# Altium schematic sheet TC264MCU.SchDoc
size A2
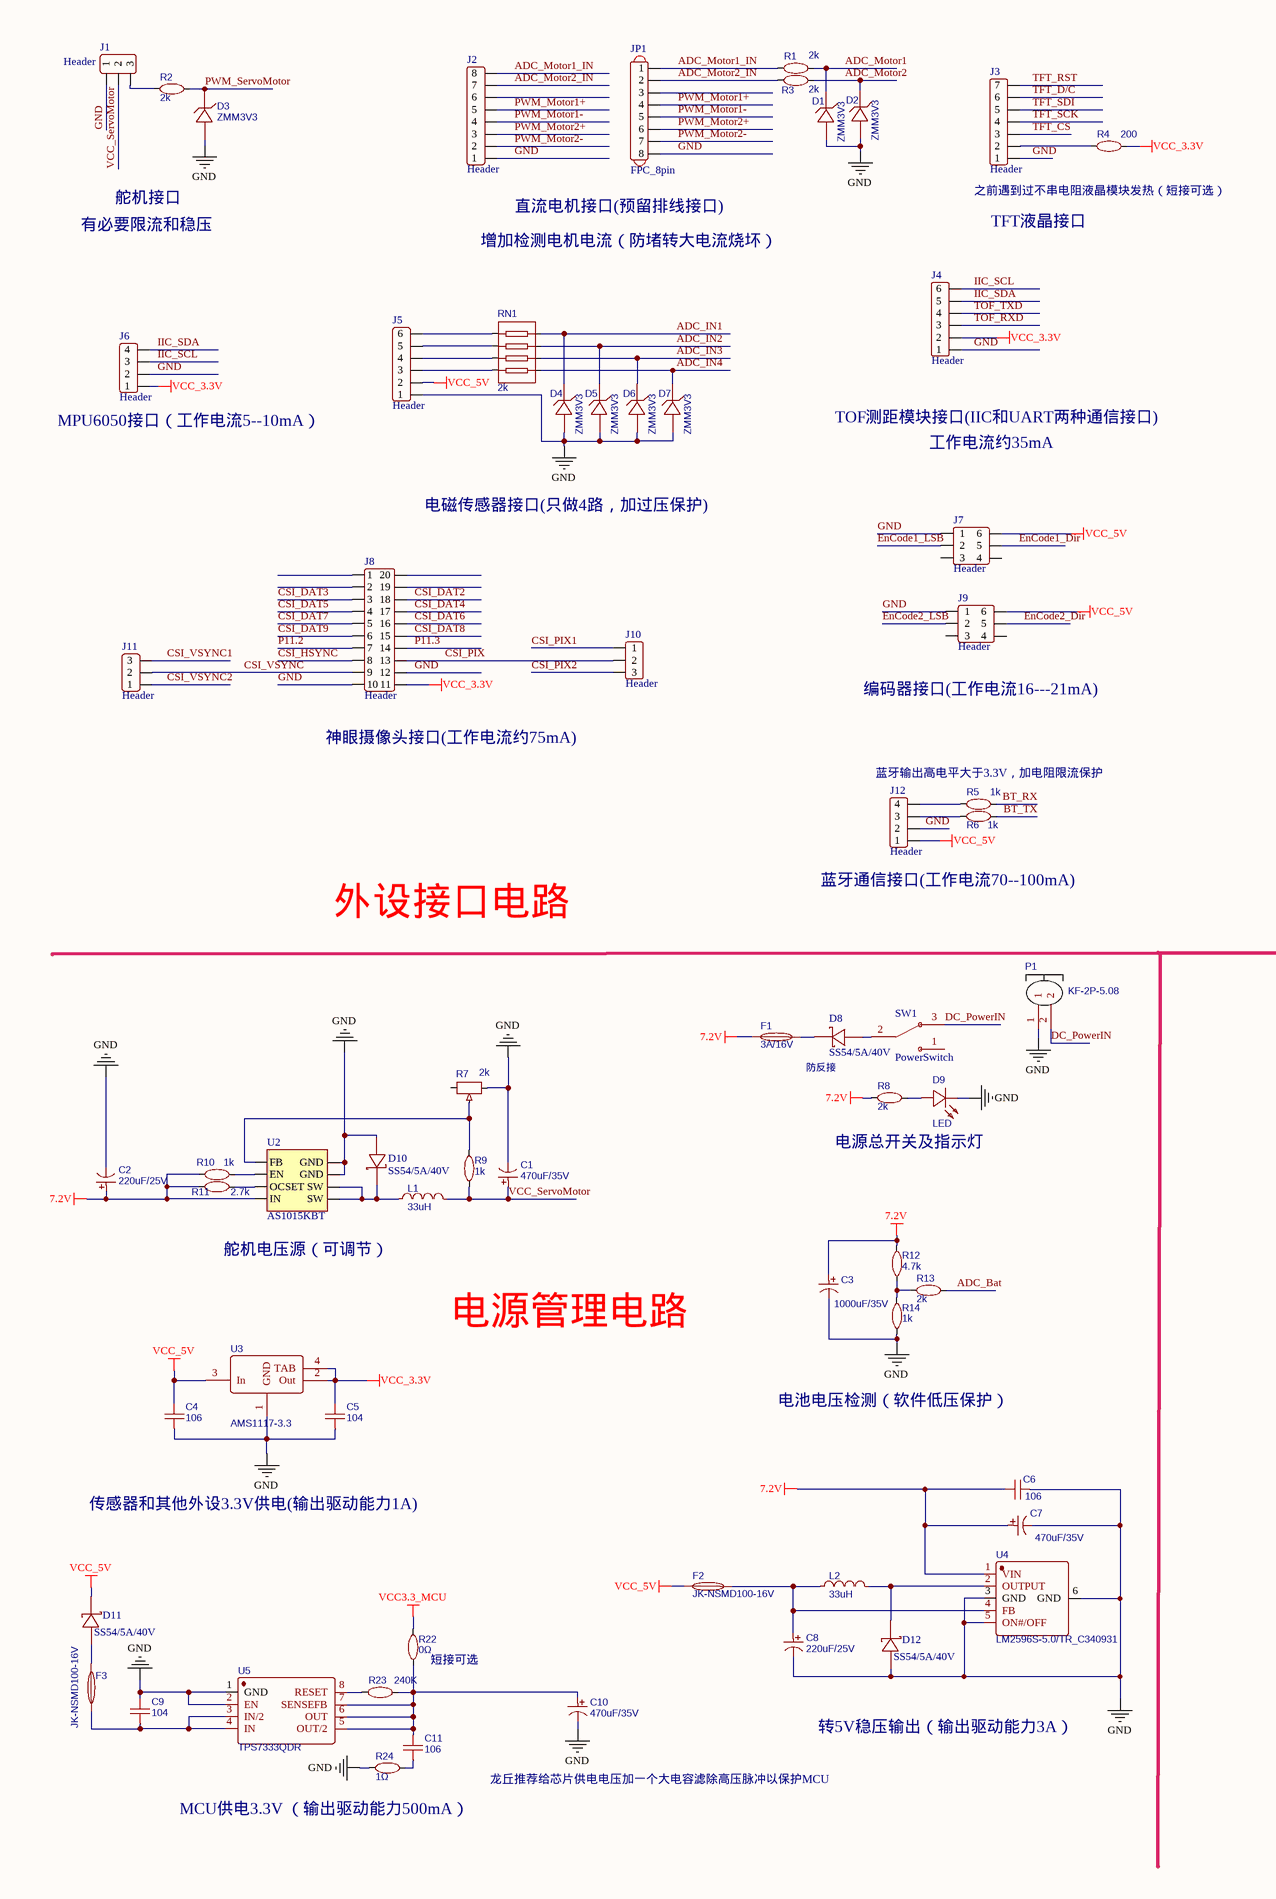
[diagram p0: TC264MCU.SchDoc, left]
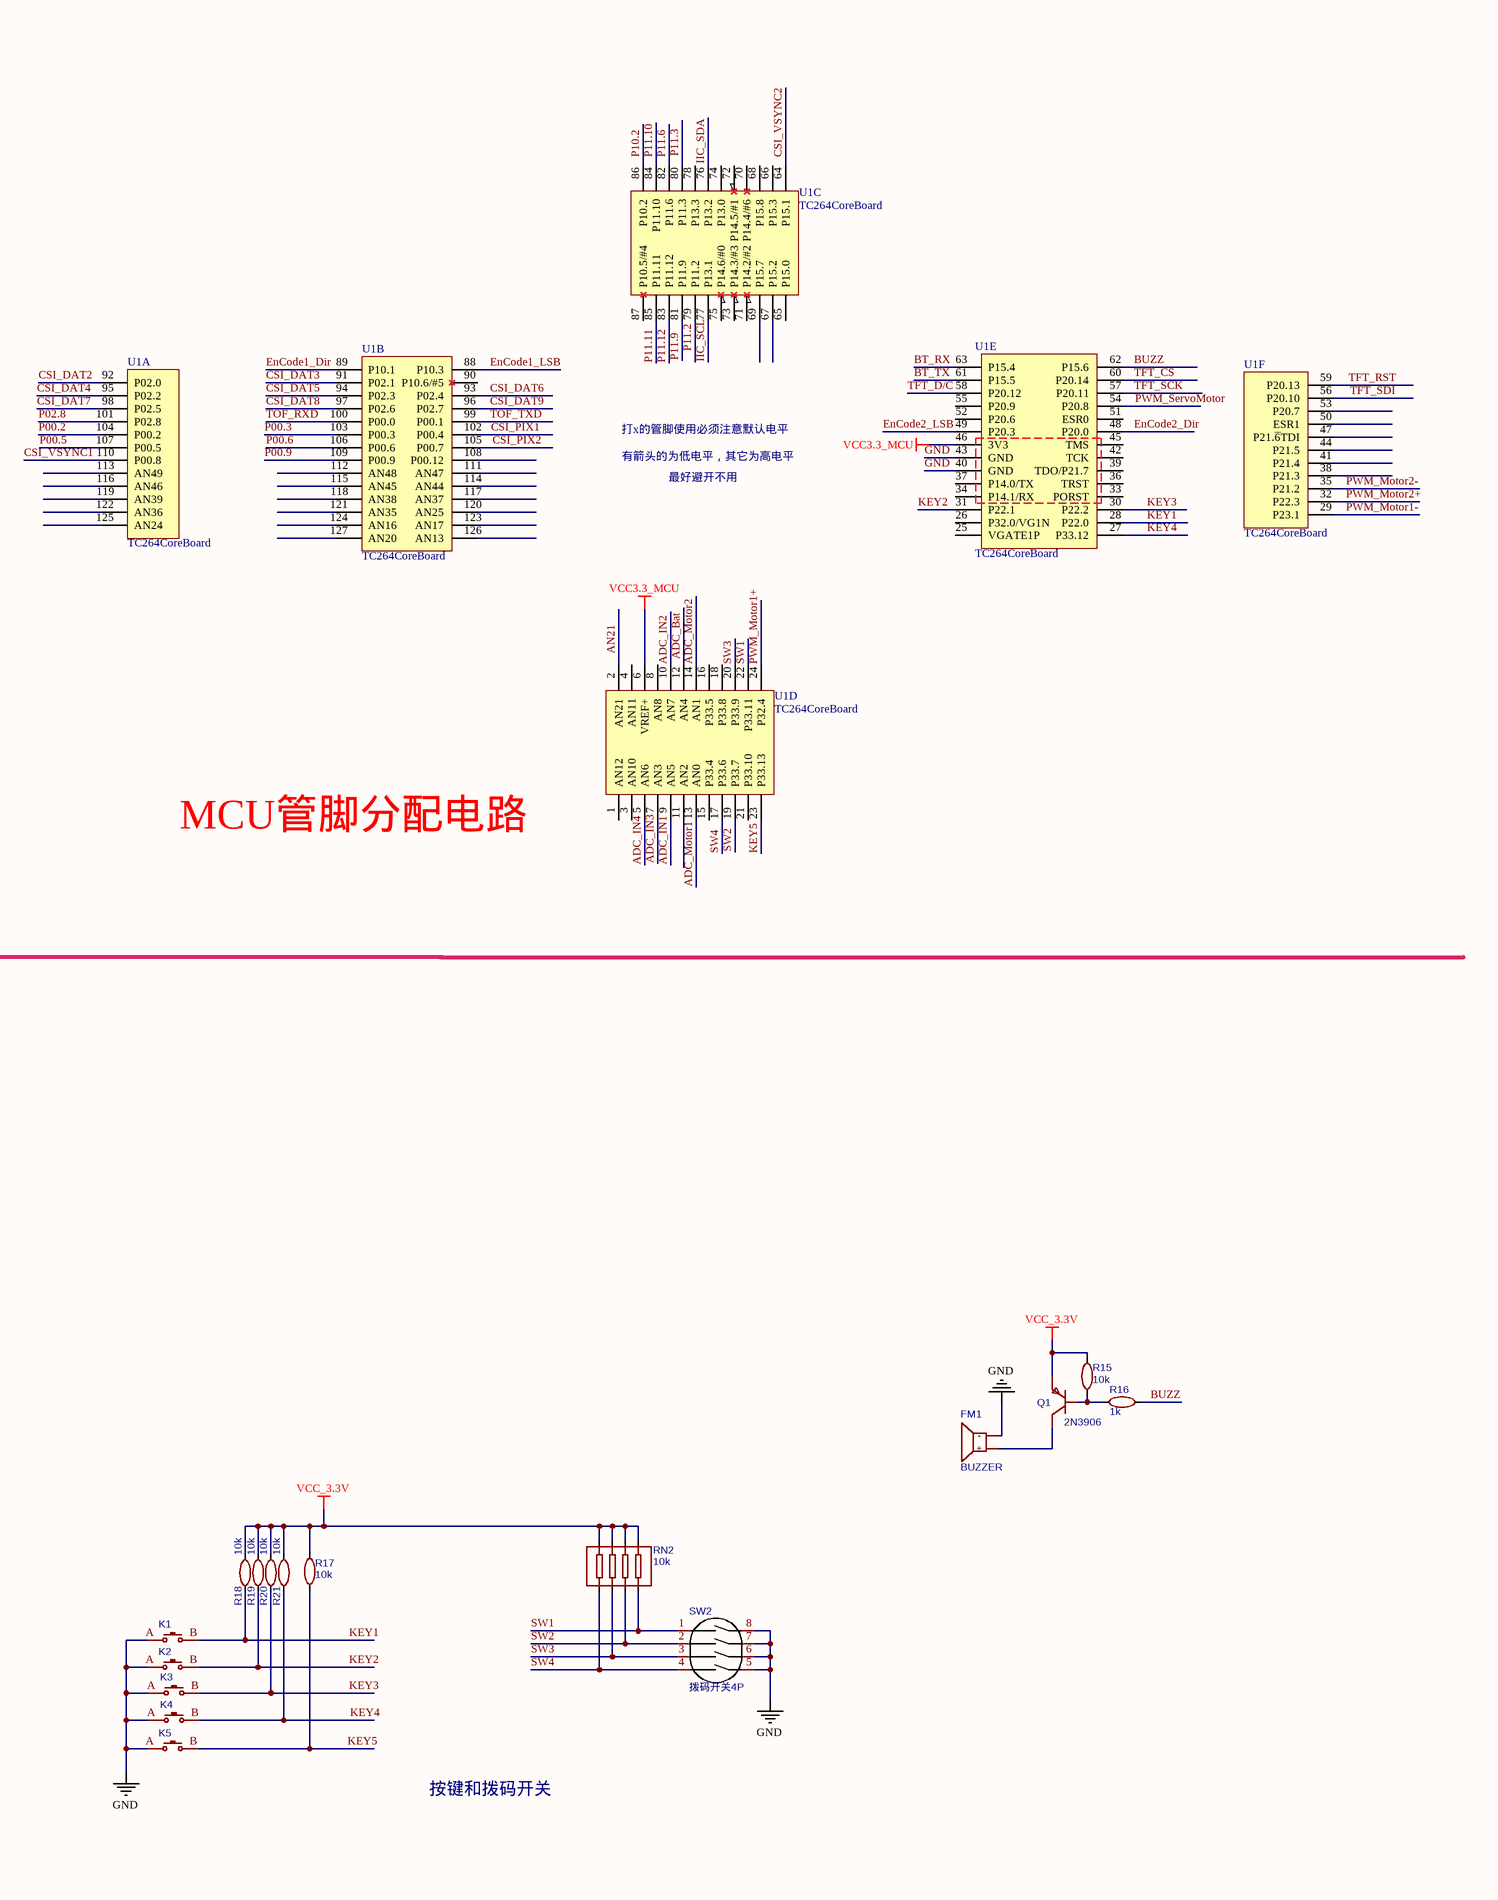
[diagram p1: TC264MCU.SchDoc, right]

## Parts
C1  470uF/35V  [CAPE_SMD_F_8.4]
C2  220uF/25V  [CAPE_SMD_D_6.4]
C3  1000uF/35V  [CAPE_SMD_G_10.6]
C4  106  [CAP_0603]
C5  104  [CAP_0603]
C6  106  [CAP_0603]
C7  470uF/35V  [CAPE_SMD_F_8.4]
C8  220uF/25V  [CAPE_SMD_D_6.4]
C9  104  [CAP_0603]
C10  470uF/35V  [CAPE_SMD_F_8.4]
C11  106  [CAP_0603]
D1  ZMM3V3  [LL-34_L3.5-W1.5-RD]
D2  ZMM3V3  [LL-34_L3.5-W1.5-RD]
D3  ZMM3V3  [LL-34_L3.5-W1.5-RD]
D4  ZMM3V3  [LL-34_L3.5-W1.5-RD]
D5  ZMM3V3  [LL-34_L3.5-W1.5-RD]
D6  ZMM3V3  [LL-34_L3.5-W1.5-RD]
D7  ZMM3V3  [LL-34_L3.5-W1.5-RD]
D8  SS54/5A/40V  [DO214_SMA]
D9  LED  [LED_0603_B]
D10  SS54/5A/40V  [DO214_SMA]
D11  SS54/5A/40V  [DO214_SMA]
D12  SS54/5A/40V  [DO214_SMA]
F1  3A/16V  [F1206]
F2  JK-NSMD100-16V  [F1206]
F3  JK-NSMD100-16V  [F1206]
FM1  BUZZER  [BUZZ-12*7.5]
J1  Header  [Header 2.54X3]
J2  Header  [Header 2.54X8]
J3  Header  [Header F 2.54X7]
J4  Header  [Header 2.54X6]
J5  Header  [Header 2.54X6]
J6  Header  [Header 2.54X4]
J7  Header  [Header 2.54_2X3]
J8  Header  [Header F 2.54_2x10]
J9  Header  [Header 2.54_2X3]
J10  Header  [Header 2.54X3]
J11  Header  [Header 2.54X3]
J12  Header  [Header F 2.54X4]
JP1  FPC_8pin  [FPC_1.0_8P]
K1  TS-Button_2P  [SW_SMD_6.1*3.7]  (value not drawn)
K2  TS-Button_2P  [SW_SMD_6.1*3.7]  (value not drawn)
K3  TS-Button_2P  [SW_SMD_6.1*3.7]  (value not drawn)
K4  TS-Button_2P  [SW_SMD_6.1*3.7]  (value not drawn)
K5  TS-Button_2P  [SW_SMD_6.1*3.7]  (value not drawn)
L1  33uH  [IND-SMD_L8.0-W8.0]
L2  33uH  [IND-SMD_L8.0-W8.0]
P1  KF-2P-5.08  [KF_2P-5.08]
Q1  2N3906  [TO_92A]
R1  2k  [RES_0603]
R2  2k  [RES_0603]
R3  2k  [RES_0603]
R4  200  [RES_0603]
R5  1k  [RES_0603]
R6  1k  [RES_0603]
R7  2k  [RES_POT-3296W]
R8  2k  [RES_0603]
R9  1k  [RES_0603]
R10  1k  [RES_0603]
R11  2.7k  [RES_0603]
R12  4.7k  [RES_0603]
R13  2k  [RES_0603]
R14  1k  [RES_0603]
R15  10k  [RES_0603]
R16  1k  [RES_0603]
R17  10k  [RES_0603]
R18  10k  [RES_0603]
R19  10k  [RES_0603]
R20  10k  [RES_0603]
R21  10k  [RES_0603]
R22  0Ω  [RES_0603]
R23  240K  [RES_0603]
R24  1Ω  [RES_0603]
RN1  2k  [RES-ARRAY-SMD_0603-8P-L3.2-W1.6-BL]
RN2  10k  [RES-ARRAY-SMD_0603-8P-L3.2-W1.6-BL]
SW1  PowerSwitch  [SW-TH_K3-1260D-K1]
SW2  拨码开关4P  [MCEMR-04-T]
U1  TC264CoreBoard  [LQ-TC264-SYSVC-S]  (parts A,B,C,D,E,F of 6)
U2  AS1015KBT  [SOIC-8_150MIL]
U3  AMS1117-3.3  [SOT-223_3]
U4  LM2596S-5.0/TR_C340931  [TO-263_5]
U5  TPS7333QDR  [SOIC-8_150MIL]

## Nets
7.2V: C2.1 C3.1 C6.1 C7.1 F1.2 R8.2 R10.1 R11.1 R12.1 U2.4(IN) U4.1(VIN)
GND: C1.2 C2.2 C3.2 C4.2 C5.2 C6.2 C7.2 C8.2 C9.1 C10.2 D1.2(A) D2.2(A) D3.2(A) D4.2(A) D5.2(A) D6.2(A) D7.2(A) D9.C D10.1(A) D12.1(A) FM1.2(－) J1.1 J2.1 J3.1 J4.1 J5.1 J6.2 J7.1 J8.10 J8.12 J9.1 J12.2 JP1.8 K1.A K2.A K3.A K4.A K5.A P1.1 R7.1 R14.2 R24.1 SW2.5 SW2.6 SW2.7 SW2.8 U1.40(GND) U1.43(GND) U2.7(GND) U2.8(GND) U3.1(GND) U4.3(GND) U4.5(ON#/OFF) U4.6(GND) U5.1(GND) U5.2(EN)
VCC3.3_MCU: R22.2 U1.6(VREF+) U1.46(3V3)
VCC_3.3V: C5.1 J4.2 J6.1 J8.11 Q1.1(E) R4.1 R15.1 R17.2 R18.2 R19.2 R20.2 R21.2 RN2.5 RN2.6 RN2.7 RN2.8 U3.2(Out) U3.4(TAB)
VCC_5V: C4.1 D11.2(C) F2.2 J5.2 J7.6 J9.6 J12.1 U3.3(In)
ADC_Bat: R13.2 U1.12(AN4)
ADC_IN1: D4.1(C) RN1.8 U1.9(AN5)
ADC_IN2: D5.1(C) RN1.7 U1.10(AN7)
ADC_IN3: D6.1(C) RN1.6 U1.7(AN3)
ADC_IN4: D7.1(C) RN1.5 U1.5(AN6)
ADC_Motor1: D1.1(C) R1.1 U1.13(AN0)
ADC_Motor1_IN: J2.8 JP1.1 R1.2
ADC_Motor2: D2.1(C) R3.1 U1.14(AN1)
ADC_Motor2_IN: J2.7 JP1.2 R3.2
AN21: U1.2(AN21)
BT_RX: R5.1 U1.63(P15.4)
BT_TX: R6.1 U1.61(P15.5)
BUZZ: R16.1 U1.62(P15.6)
CSI_DAT2: J8.18 U1.92(P02.0)
CSI_DAT3: J8.3 U1.91(P02.1)
CSI_DAT4: J8.17 U1.95(P02.2)
CSI_DAT5: J8.4 U1.94(P02.3)
CSI_DAT6: J8.16 U1.93(P02.4)
CSI_DAT7: J8.5 U1.98(P02.5)
CSI_DAT8: J8.15 U1.97(P02.6)
CSI_DAT9: J8.6 U1.96(P02.7)
CSI_HSYNC: J8.8
CSI_PIX: J8.13 J10.2
CSI_PIX1: J10.1 U1.102(P00.4)
CSI_PIX2: J10.3 U1.105(P00.7)
CSI_VSYNC: J8.9 J11.2
CSI_VSYNC1: J11.3 U1.110(P00.8)
CSI_VSYNC2: J11.1 U1.64(P15.1)
DC_PowerIN: P1.2 SW1.3(NC)
EnCode1_Dir: J7.5 U1.89(P10.1)
EnCode1_LSB: J7.2 U1.88(P10.3)
EnCode2_Dir: J9.5 U1.48(P20.0)
EnCode2_LSB: J9.2 U1.49(P20.3)
IIC_SCL: J4.6 J6.3 U1.77(P13.1)
IIC_SDA: J4.5 J6.4 U1.76(P13.2)
KEY1: K1.B R18.1 U1.28(P22.0)
KEY2: K2.B R19.1 U1.31(P22.1)
KEY3: K3.B R20.1 U1.30(P22.2)
KEY4: K4.B R21.1 U1.27(P33.12)
KEY5: K5.B R17.1 U1.23(P33.13)
P00.2: U1.104(P00.2)
P00.3: U1.103(P00.3)
P00.5: U1.107(P00.5)
P00.6: U1.106(P00.6)
P00.9: U1.109(P00.9)
P02.8: U1.101(P02.8)
P10.2: U1.86(P10.2)
P11.2: J8.7 U1.79(P11.2)
P11.3: J8.14 U1.80(P11.3)
P11.6: U1.82(P11.6)
P11.9: U1.81(P11.9)
P11.10: U1.84(P11.10)
P11.11: U1.85(P11.11)
P11.12: U1.83(P11.12)
PWM_Motor1+: J2.5 JP1.4 U1.24(P32.4)
PWM_Motor1-: J2.4 JP1.5 U1.29(P23.1)
PWM_Motor2+: J2.3 JP1.6 U1.32(P22.3)
PWM_Motor2-: J2.2 JP1.7 U1.35(P21.2)
PWM_ServoMotor: D3.1(C) R2.1 U1.54(P20.8)
SW1: RN2.4 SW2.1 U1.22(P33.11)
SW2: RN2.3 SW2.2 U1.19(P33.7)
SW3: RN2.2 SW2.3 U1.20(P33.9)
SW4: RN2.1 SW2.4 U1.17(P33.6)
TFT_CS: J3.3 U1.60(P20.14)
TFT_D/C: J3.6 U1.58(P20.12)
TFT_RST: J3.7 U1.59(P20.13)
TFT_SCK: J3.4 U1.57(P20.11)
TFT_SDI: J3.5 U1.56(P20.10)
TOF_RXD: J4.3 U1.100(P00.0)
TOF_TXD: J4.4 U1.99(P00.1)
VCC_ServoMotor: C1.1 J1.2 L1.2 R9.1
NetC8_1: C8.1 F2.1 L2.1 U4.4(FB)
NetC9_2: C9.2 F3.1 U5.3(IN/2) U5.4(IN)
NetC10_1: C10.1 C11.1 R22.1 R23.2 U5.5(OUT/2) U5.6(OUT) U5.7(SENSEFB)
NetC11_2: C11.2 R24.2
NetD8_1: D8.1(A) SW1.2(C)
NetD8_2: D8.2(C) F1.1
NetD9_A: D9.A R8.1
NetD10_2: D10.2(C) L1.1 U2.5(SW) U2.6(SW)
NetD11_1: D11.1(A) F3.2
NetD12_2: D12.2(C) L2.2 U4.2(OUTPUT)
NetFM1_1: FM1.1(+) Q1.3(C)
NetJ1_3: J1.3 R2.2
NetJ3_2: J3.2 R4.2
NetJ5_3: J5.3 RN1.4
NetJ5_4: J5.4 RN1.3
NetJ5_5: J5.5 RN1.2
NetJ5_6: J5.6 RN1.1
NetJ12_3: J12.3 R6.2
NetJ12_4: J12.4 R5.2
NetQ1_2: Q1.2(B) R15.2 R16.2
NetR7_2: R7.2 R9.2 U2.1(FB)
NetR10_2: R10.2 U2.2(EN)
NetR11_2: R11.2 U2.3(OCSET)
NetR12_2: R12.2 R13.1 R14.1
NetR23_1: R23.1 U5.8(RESET)

Not connected (* = marked no-connect by the designer): J2 6; J7 3 4; J8 1 2 19 20; J9 3 4; JP1 3; R7 3; SW1 1(ON); U1 1(AN12) 3(AN10) 4(AN11) 8(AN8) 11(AN2) 15(P33.4) 16(P33.5) 18(P33.8) 21(P33.10) 25(VGATE1P) 26(P32.0/VG1N) 33(PORST) 34(P14.1/RX) 36(TRST) 37(P14.0/TX) 38(P21.3) 39(TDO/P21.7) 41(P21.4) 42(TCK) 44(P21.5) 45(TMS) 47(P21.~{6}TDI) 50(ESR1) 51(ESR0) 52(P20.6) 53(P20.7) 55(P20.9) 65(P15.0) 66(P15.3) 67(P15.2) 68(P15.8) 69(P15.7) 70(P14.4/#6) 71(P14.2/#2) 72(P14.5/#1) 73(P14.3/#3) 74(P13.0) 75(P14.6/#0) 78(P13.3) 87(P10.5/#4) 90(P10.6/#5) 108(P00.12) 111(AN47) 112(AN48) 113(AN49) 114(AN44) 115(AN45) 116(AN46) 117(AN37) 118(AN38) 119(AN39) 120(AN25) 121(AN35) 122(AN36) 123(AN17) 124(AN16) 125(AN24) 126(AN13) 127(AN20)

## Notes on the sheet
- 舵机接口
- 直流电机接口(预留排线接口)
- 之前遇到过不串电阻液晶模块发热（短接可选）
- TFT液晶接口
- 有必要限流和稳压
- 增加检测电机电流（防堵转大电流烧坏）
- (near J6) MPU6050接口（工作电流5--10mA）
- TOF测距模块接口(IIC和UART两种通信接口)
- 工作电流约35mA
- 打x的管脚使用必须注意默认电平
- 电磁传感器接口(只做4路，加过压保护)
- 有箭头的为低电平，其它为高电平
- 最好避开不用
- (near J9) 编码器接口(工作电流16---21mA)
- (near J8) 神眼摄像头接口(工作电流约75mA)
- 蓝牙输出高电平大于3.3V，加电阻限流保护
- MCU管脚分配电路
- (near J12) 蓝牙通信接口(工作电流70--100mA)
- 外设接口电路
- 防反接
- 电源总开关及指示灯
- 舵机电压源（可调节）
- 电源管理电路
- 电池电压检测（软件低压保护）
- 传感器和其他外设3.3V供电(输出驱动能力1A)
- (near R22) 短接可选
- 转5V稳压输出（输出驱动能力3A）
- 按键和拨码开关
- 龙丘推荐给芯片供电电压加一个大电容滤除高压脉冲以保护MCU
- (near R24) MCU供电3.3V （输出驱动能力500mA）

## Library data of the parts
C1-C3 C7 C8 C10 = CAP_E_SMD: 贴片电解电容; BOM_Manufacturer: ROQANG; BOM_Manufacturer Part: RVT1C221M0607; nameAlias: Capacitance; BOM_Supplier: LCSC; BOM_Supplier Part: C72496; spicePre: C; spiceSymbolName: RVT1C221M0607
C4-C6 C9 C11 = CAP_0603: BOM_Manufacturer: Samsung Electro-Mechanics; BOM_Manufacturer Part: CL10B104KB8WPNC; nameAlias: Capacitance; Contributor: LCSC; BOM_Supplier: LCSC; BOM_Supplier Part: C307348; spicePre: C; spiceSymbolName: CL10B104KB8WPNC
D1-D7 = ZMM3V3: BOM_Manufacturer: SEMTECH; SMT Type: Basic; BOM_Supplier: LCSC; BOM_Manufacturer Part: ZMM3V3; BOM_LCSC Assembly: Yes; image: //image.lceda.cn/szlcsc/C8056.jpg; BOM_Supplier Part: C8056; spicePre: D; spiceSymbolName: ZMM3V3
D8 D10-D12 = SS54
D9 = LED_0603: 发光LED; BOM_Manufacturer: ARKLED; BOM_Manufacturer Part: D-G080508G1; Contributor: LCSC; BOM_Supplier: LCSC; BOM_Supplier Part: C107402; spicePre: L; spiceSymbolName: D-G080508G1
F1-F3 = JK-NSMD100-16V: BOM_Manufacturer: Jinrui Electronic Materials Co.; Contributor: LCSC; BOM_Supplier: LCSC; BOM_Supplier Part: C369161; BOM_Manufacturer Part: JK-NSMD100-16V; spicePre: F; spiceSymbolName: JK-NSMD100-16V
FM1 = BUZZER: 蜂鸣器; BOM_Manufacturer: HNDZ; BOM_Manufacturer Part: TMB12A12; BOM_Supplier: LCSC; BOM_Supplier Part: C96079; spicePre: B; spiceSymbolName: TMB12A12
J1 J10 J11 = Header 2.54_3
J2 = Header 2.54_8
J3 = Header 2.54_7
J4 J5 = Header 2.54_6
J6 J12 = Header 2.54_4
J7 J9 = Header 2.54_2X3
J8 = Header 2.54_2X10
K1-K5 = TS-Button_2P: 贴片按键 3*6*2.5; BOM_Manufacturer: XUNPU; BOM_Manufacturer Part: TS-1007S-26; Contributor: LCSC; BOM_Supplier: LCSC; BOM_Supplier Part: C455236; spicePre: S; spiceSymbolName: TS-1007S-26
L1 L2 = Inductor: BOM_Manufacturer: TDK; BOM_Manufacturer Part: NLV25T-330J-EF; nameAlias: Inductance; Contributor: LCSC; BOM_Supplier: LCSC; BOM_Supplier Part: C295130; spicePre: L; spiceSymbolName: NLV25T-330J-EF
P1 = KF-2P-5.08: 端子2P; BOM_Manufacturer: ReliaPro; BOM_Manufacturer Part: WJ500H-5.08-2P; BOM_Supplier: LCSC; image: //image.lceda.cn/szlcsc/C8478.jpg; BOM_Supplier Part: C8478; spicePre: P; spiceSymbolName: WJ500H-5.08-2P
Q1 = 2N3906: 三极管PNP; BOM_Manufacturer: BLUE ROCKET; Contributor: LCSC; BOM_Supplier: LCSC; BOM_Supplier Part: C305396; BOM_Manufacturer Part: 2N3906; spicePre: Q; spiceSymbolName: 2N3906_C305396
R1-R6 R8-R24 = RES_0603: BOM_Manufacturer: YAGEO; BOM_Manufacturer Part: RC0402JR-07100KL; nameAlias: Resistance (Ohms); BOM_Supplier: LCSC; BOM_Supplier Part: C106234; spicePre: R; spiceSymbolName: RC0402JR-07100KL
R7 = RES_POT-3296W: 可调电阻3296W; BOM_Manufacturer: Chengdu Guosheng Tech; BOM_Manufacturer Part: 3296W-1-104; Resistance(Ohms): 100K; nameAlias: Resistance (Ohms); Contributor: LCSC; BOM_Supplier: LCSC; BOM_Supplier Part: C118963; spicePre: R; spiceSymbolName: 3296W-1-104
RN1 RN2 = RESW4: BOM_Manufacturer: YAGEO; BOM_Manufacturer Part: YC164-JR-0710KL; nameAlias: Resistance (Ohms); BOM_Supplier: LCSC; BOM_Supplier Part: C107374; spicePre: R; spiceSymbolName: YC164-JR-0710KL
SW2 = 拨码开关4P: DIP_4PX2*2.54; BOM_Manufacturer: ReliaPro; BOM_Manufacturer Part: VDG/S-04HG-R; BOM_Supplier: LCSC; image: //image.lceda.cn/szlcsc/C15781.jpg; BOM_Supplier Part: C15781; spicePre: D; spiceSymbolName: VDG/S-04HG-R
U3 = AMS1117-3.3: BOM_Manufacturer: SK; Contributor: LCSC; SMT Type: Extend; BOM_Supplier: LCSC; BOM_Supplier Part: C165482; BOM_Manufacturer Part: AMS1117-3.3; BOM_LCSC Assembly: Yes; spicePre: U; spiceSymbolName: AMS1117-3.3_C165482
U4 = LM2596S-5.0/TR_C340931: BOM_Manufacturer: Huaguan Semicon; Contributor: LCSC; BOM_Supplier: LCSC; BOM_Supplier Part: C340931; BOM_Manufacturer Part: LM2596S-5.0/TR; spicePre: U; spiceSymbolName: LM2596S-5.0/TR_C340931
U5 = TPS7333QDR: BOM_Manufacturer: TI; SMT Type: Extend; spicePre: X; BOM_Supplier: LCSC; BOM_Manufacturer Part: TPS7333QDR; image: //image.lceda.cn/szlcsc/C23791.jpg; BOM_Supplier Part: C23791; BOM_LCSC Assembly: Yes; spiceSymbolName: TPS7333QDR